# Altium schematic sheet Switches.SchDoc
size A; SheetNumber: 7
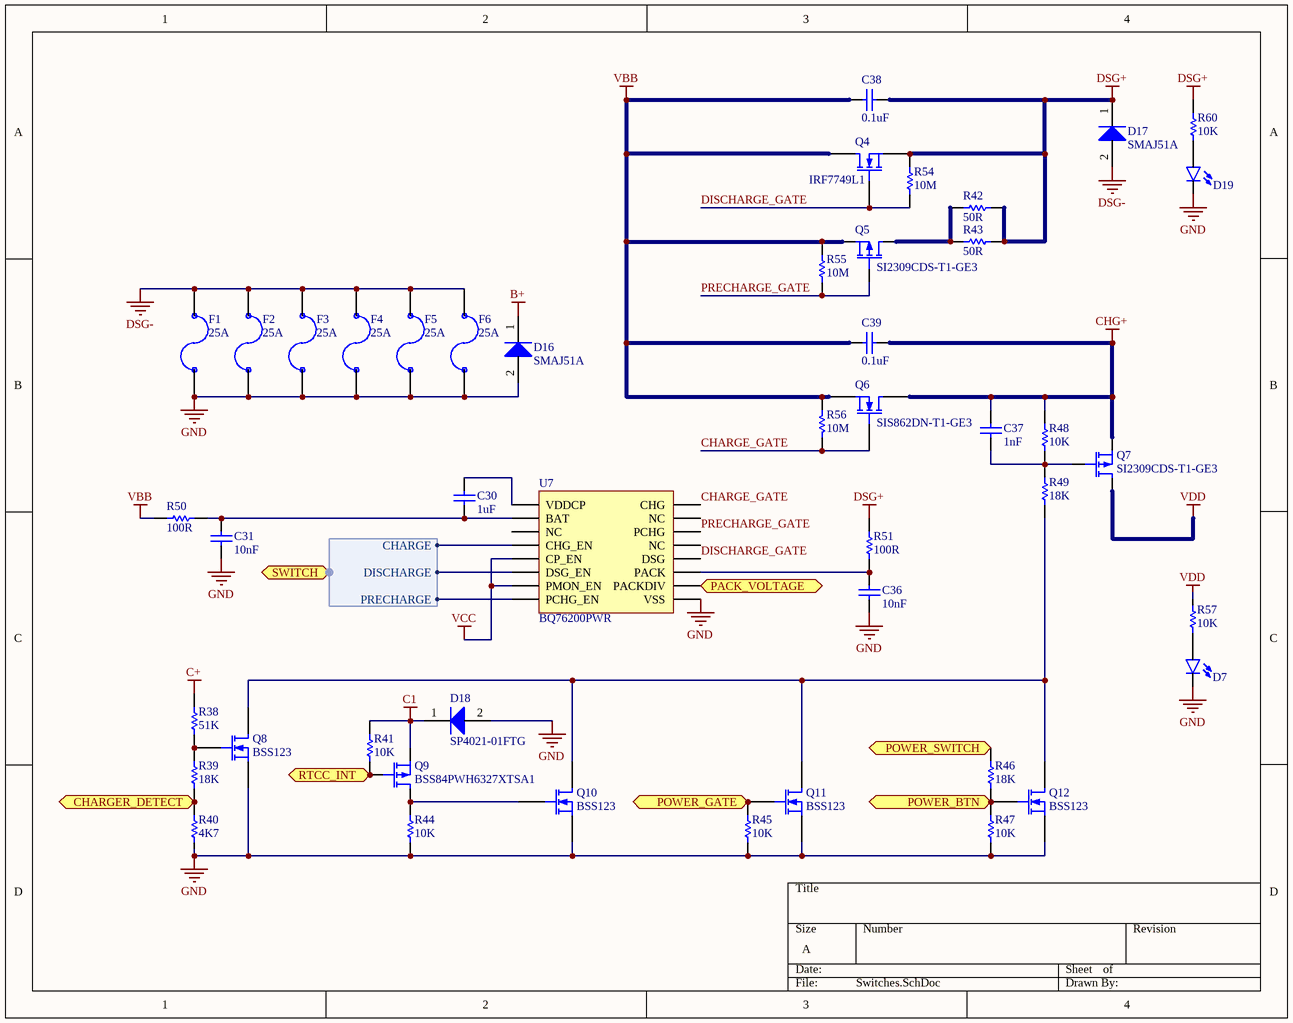
[diagram p0: Switches.SchDoc]

## Parts
C30  value 1uF  [C0603[1608X92]]  (hidden comment: 1uF 50V 0603)
C31  value 10nF  [C0402[1005X55]]  (hidden comment: 10nF 100V 0402)
C36  value 10nF  [C0402[1005X55]]  (hidden comment: 10nF 100V 0402)
C37  value 1nF  [C0402[1005X55]]  (hidden comment: 1nF 50V 0402)
C38  value 0.1uF  [C0402[1005X55]]  (hidden comment: 0.1uF 100V 0402)
C39  value 0.1uF  [C0402[1005X55]]  (hidden comment: 0.1uF 100V 0402)
D7  LED-BLUE  [LED0603]  (value not drawn)
D16  SMAJ51A  [DO-214AC]
D17  SMAJ51A  [DO-214AC]
D18  SP4021-01FTG  [SOD-323]
D19  LED-BLUE  [LED0603]  (value not drawn)
F1  Current: 25A  [1206_FUSE]  (hidden comment: FUSE 1206)
F2  Current: 25A  [1206_FUSE]  (hidden comment: FUSE 1206)
F3  Current: 25A  [1206_FUSE]  (hidden comment: FUSE 1206)
F4  Current: 25A  [1206_FUSE]  (hidden comment: FUSE 1206)
F5  Current: 25A  [1206_FUSE]  (hidden comment: FUSE 1206)
F6  Current: 25A  [1206_FUSE]  (hidden comment: FUSE 1206)
Q4  IRF7749L1  [DIRECTFET-9]
Q5  SI2309CDS-T1-GE3  [SOT23-3]
Q6  SIS862DN-T1-GE3  [PowerPak-1212-8]
Q7  SI2309CDS-T1-GE3  [SOT23-3]
Q8  BSS123  [SOT323-3]
Q9  BSS84PWH6327XTSA1  [SOT323-3]
Q10  BSS123  [SOT323-3]
Q11  BSS123  [SOT323-3]
Q12  BSS123  [SOT323-3]
R38  value 51K  [R0402[1005]]  (hidden comment: 51K 1% 0402)
R39  value 18K  [R0402[1005]]  (hidden comment: 18K 1% 0402)
R40  value 4K7  [R0402[1005]]  (hidden comment: 4K7 1% 0402)
R41  value 10K  [R0402[1005]]  (hidden comment: 10K 1% 0402)
R42  value 50R  [R1206[3216]]  (hidden comment: 50R 2% 1206)
R43  value 50R  [R1206[3216]]  (hidden comment: 50R 2% 1206)
R44  value 10K  [R0402[1005]]  (hidden comment: 10K 1% 0402)
R45  value 10K  [R0402[1005]]  (hidden comment: 10K 1% 0402)
R46  value 18K  [R0402[1005]]  (hidden comment: 18K 1% 0402)
R47  value 10K  [R0402[1005]]  (hidden comment: 10K 1% 0402)
R48  value 10K  [R0402[1005]]  (hidden comment: 10K 1% 0402)
R49  value 18K  [R0402[1005]]  (hidden comment: 18K 1% 0402)
R50  value 100R  [R0402[1005]]  (hidden comment: 100R 1% 0402)
R51  value 100R  [R0402[1005]]  (hidden comment: 100R 1% 0402)
R54  value 10M  [R0402[1005]]  (hidden comment: 10M 1% 0402)
R55  value 10M  [R0402[1005]]  (hidden comment: 10M 1% 0402)
R56  value 10M  [R0402[1005]]  (hidden comment: 10M 1% 0402)
R57  value 10K  [R0603[1608]]  (hidden comment: 10K 1% 0603)
R60  value 10K  [R0603[1608]]  (hidden comment: 10K 1% 0603)
U7  BQ76200PWR  [TSSOP-16]

## Ports
CHARGER_DETECT (out), PACK_VOLTAGE (out), POWER_BTN (out), POWER_GATE (in), POWER_SWITCH (in), RTCC_INT (in), SWITCH (harness Switches)

## Harnesses
Switches: CHARGE, DISCHARGE, PRECHARGE

## Nets
B+: D16.1(K)
C1: D18.1(K) Q9.2(S) R41.2
C+: R38.2
CHG+: C37.2 C39.2 Q6.3(D) Q7.3(S) R48.2
DSG+: C38.2 D17.1(K) Q4.2(S) R42.2 R43.2 R51.2 R54.2 R60.2
DSG-: D17.2(A) F1.1 F2.1 F3.1 F4.1 F5.1 F6.1
GND: C31.1 C36.1 D7.C D16.2(A) D18.2(A) D19.C F1.2 F2.2 F3.2 F4.2 F5.2 F6.2 Q8.2(S) Q10.2(S) Q11.2(S) Q12.2(S) R40.1 R44.1 R45.1 R47.1 U7.9(VSS)
VBB: C38.1 C39.1 Q4.3(D) Q5.3(S) Q6.1(S) R50.1 R55.2 R56.2
VCC: U7.5(CP_EN) U7.7(PMON_EN)
VDD: Q7.2(D) R57.2
CHARGE_GATE: Q6.2(G) R56.1 U7.16(CHG)
CHARGER_DETECT: R39.1 R40.2 ; port CHARGER_DETECT
DISCHARGE_GATE: Q4.1(G) R54.1 U7.12(DSG)
PACK_VOLTAGE: U7.10(PACKDIV) ; port PACK_VOLTAGE
POWER_BTN: Q12.1(G) R46.1 R47.2 ; port POWER_BTN
POWER_GATE: Q11.1(G) R45.2 ; port POWER_GATE
POWER_SWITCH: R46.2 ; port POWER_SWITCH
PRECHARGE_GATE: Q5.1(G) R55.1 U7.14(PCHG)
RTCC_INT: Q9.1(G) R41.1 ; port RTCC_INT
NetC30_1: C30.1 C31.2 R50.2 U7.2(BAT)
NetC30_2: C30.2 U7.1(VDDCP)
NetC36_2: C36.2 R51.1 U7.11(PACK)
NetC37_1: C37.1 Q7.1(G) R48.1 R49.2
NetD7_A: D7.A R57.1
NetD19_A: D19.A R60.1
NetQ5_2: Q5.2(D) R42.1 R43.1
NetQ8_1: Q8.1(G) R38.1 R39.2
NetQ8_3: Q8.3(D) Q10.3(D) Q11.3(D) Q12.3(D) R49.1
NetQ9_3: Q9.3(D) Q10.1(G) R44.2
NetU7_4: U7.4(CHG_EN) ; port SWITCH.CHARGE
NetU7_6: U7.6(DSG_EN) ; port SWITCH.DISCHARGE
NetU7_8: U7.8(PCHG_EN) ; port SWITCH.PRECHARGE

Not connected (* = marked no-connect by the designer): U7 3(NC) 13(NC) 15(NC)

## Library data of the parts
C30 = CAP_1uF_50V_0603_10%: 1uF 50V 10% 0603 (1608 Metric); PartNumber: GRM188R61H105KAALD; Manufacturer: Murata; Tolerance: 10%; Mounting Technology: Surface Mount; PackageReference: 0603; PackageDescription: 0603 (1608 Metric); Voltage: 50V
C31 C36 = CAP_10nF_100V_0402_10%: 10nF 100V 10% 0402 (1005 Metric); PartNumber: C1005X7S2A103K050BB; Manufacturer: TDK; Tolerance: 10%; Mounting Technology: Surface Mount; PackageReference: 0402; PackageDescription: 0402 (1005 Metric); Voltage: 100V
C37 = CAP_1nF_50V_0402_5%: 1nF 50V 5% 0402 (1005 Metric); PartNumber: GRM1555C1H102JA01D; Manufacturer: Murata; Mounting Technology: Surface Mount; PackageReference: 0402; PackageDescription: 0402 (1005 Metric); Voltage: 50V; Tolerance: 5%
C38 C39 = CAP_0.1uF_100V_0402_10%: 0.1uF 100V 10% 0402 (1005 Metric); PartNumber: GRM155R62A104KE14D; Manufacturer: Murata; Mounting Technology: Surface Mount; PackageReference: 0402; PackageDescription: 0402 (1005 Metric); Voltage: 100V; Tolerance: 10%
D7 D19 = LED_0603_GREEN_5mA: PartNumber: LTST-C193TGKT-5A; Manufacturer: Lite-On Inc.; PackageReference: 0603; PackageDescription: 0603 (1608 Metric); Mounting Technology: Surface Mount
D16 D17 = SMAJ51A-E3/61: Manufacturer: Vishay; PartNumber: SMAJ51A-E3/61; PackageReference: DO-214AC; Mounting Technology: Surface Mount; PackageDescription: DO-214AC, 2 Leads
D18 = SP4021-01FTG: Manufacturer: Littelfuse; PartNumber: SP4021-01FTG; PackageReference: SOD-323-2; Mounting Technology: Surface Mount
F1-F6 = FUSE 1206: Surface Mount Fuses UST 1206 FUSE 25A F; PartNumber: 3413.0332.22; Manufacturer: Schurter; Mounting Technology: Surface Mount; PackageReference: 1206; PackageDescription: 1206 (3216 Metric)
Q4 = IRF7749L2: N-Channel MOSFET; PartNumber: IRF7749L1TRPBF; Manufacturer: Infineon Technologies; PackageReference: DIRECTFET L8; PackageDescription: DirectFET™ Isometric L8; Mounting Technology: Surface Mount
Q5 Q7 = SI2309CDS-T1-GE3: P-Channel MOSFET; Manufacturer: Vishay; PackageReference: SOT23-3; Mounting Technology: Surface Mount; PartNumber: SI2309CDS-T1-GE3
Q6 = SIS862DN-T1-GE3: N-Channel MOSFET; Manufacturer: Vishay; PackageReference: PowerPAK-1212-8; PartNumber: SIS862DN-T1-GE3; Mounting Technology: Surface Mount
Q8 Q10-Q12 = BSS123WQ-7-F: N-Channel MOSFET; Manufacturer: Diodes Incorporated; PackageReference: SOT-323-3; PartNumber: BSS123WQ-7-F; Mounting Technology: Surface Mount
Q9 = BSS84PW H6327: P-Channel MOSFET; Manufacturer: Infineon; Mounting Technology: Surface Mount; PartNumber: BSS84PWH6327XTSA1; PackageReference: SOT323-3
R38 = RES_51K_0402_1%: 51K 0.063W 1% 0402 (1005 Metric); Manufacturer: KOA Speer; PartNumber: RK73H1ETTP5102F; Power: 0.063W; Tolerance: 1%; Mounting Technology: Surface Mount; PackageReference: 0402; PackageDescription: 0402 (1005 Metric); ComponentLink1Description: Datasheet; ComponentLink1URL: http://www.koaspeer.com/catimages/Products/RK73H/RK73H.pdf
R39 R46 R49 = RES_18K_0402_1%: 18K 0.063W 1% 0402 (1005 Metric); Manufacturer: KOA Speer; PartNumber: RK73H1ETTP1802F; Tolerance: 1%; Power: 0.063W; Mounting Technology: Surface Mount; PackageReference: 0402; PackageDescription: 0402 (1005 Metric); ComponentLink1Description: Datasheet; ComponentLink1URL: http://www.koaspeer.com/catimages/Products/RK73H/RK73H.pdf
R40 = RES_4K7_0402_1%: 4K7 0.063W 1% 0402 (1005 Metric); Manufacturer: KOA Speer; PartNumber: RK73H1ETTP4701F; Tolerance: 1%; Power: 0.063W; Mounting Technology: Surface Mount; PackageReference: 0402; PackageDescription: 0402 (1005 Metric); ComponentLink1Description: Datasheet; ComponentLink1URL: http://www.koaspeer.com/catimages/Products/RK73H/RK73H.pdf
R41 R44 R45 R47 R48 = RES_10K_0402_1%: 10K 0.063W 1% 0402 (1005 Metric); Manufacturer: KOA Speer; PartNumber: RK73H1ETTP1002F; Tolerance: 1%; Power: 0.063W; Mounting Technology: Surface Mount; PackageReference: 0402; PackageDescription: 0402 (1005 Metric); ComponentLink1Description: Datasheet; ComponentLink1URL: http://www.koaspeer.com/catimages/Products/RK73H/RK73H.pdf
R42 R43 = RES_50R_1206_2%: 50R 2.4W 2% 1206 (3216 Metric); Manufacturer: Vishay; PartNumber: RCP1206W50R0GEB; Tolerance: 2%; Power: 2.4W; Mounting Technology: Surface Mount; PackageReference: 1206; PackageDescription: 1206 (3216 Metric); ComponentLink1Description: Datasheet; ComponentLink1URL: http://www.vishay.com/docs/31098/rcp.pdf
R50 R51 = RES_100R_0402_1%: 100R 0.063W 1% 0402 (1005 Metric); Manufacturer: KOA Speer; PartNumber: RK73H1ETTP1000F; Power: 0.063W; Tolerance: 1%; Mounting Technology: Surface Mount; PackageReference: 0402; PackageDescription: 0402 (1005 Metric); ComponentLink1Description: Datasheet; ComponentLink1URL: http://www.koaspeer.com/catimages/Products/RK73H/RK73H.pdf
R54-R56 = RES_10M_0402_1%: 10M 0.063W 1% 0402 (1005 Metric); Manufacturer: KOA Speer; PartNumber: RK73H1ETTP1005F; Tolerance: 1%; Power: 0.063W; Mounting Technology: Surface Mount; PackageReference: 0402; PackageDescription: 0402 (1005 Metric); ComponentLink1Description: Datasheet; ComponentLink1URL: http://www.koaspeer.com/catimages/Products/RK73H/RK73H.pdf
R57 R60 = RES_10K_0603_1%: 10K 0.25W 1% 0603 (1005 Metric); Manufacturer: Vishay; PartNumber: RCS060310K0FKEA; Tolerance: 1%; Power: 0.25W; Mounting Technology: Surface Mount; PackageReference: 0603; PackageDescription: 0603 (1608 Metric); ComponentLink1Description: Datasheet; ComponentLink1URL: http://www.vishay.com/docs/20065/rcse3.pdf
U7 = BQ76200PWR: Battery Management Fast high side NCH drive; Manufacturer: Texas Instruments; PartNumber: BQ76200PWR; PackageReference: TSSOP-16; Mounting Technology: Surface Mount